# EAGLE design Div (EAGLE 8.4.0)
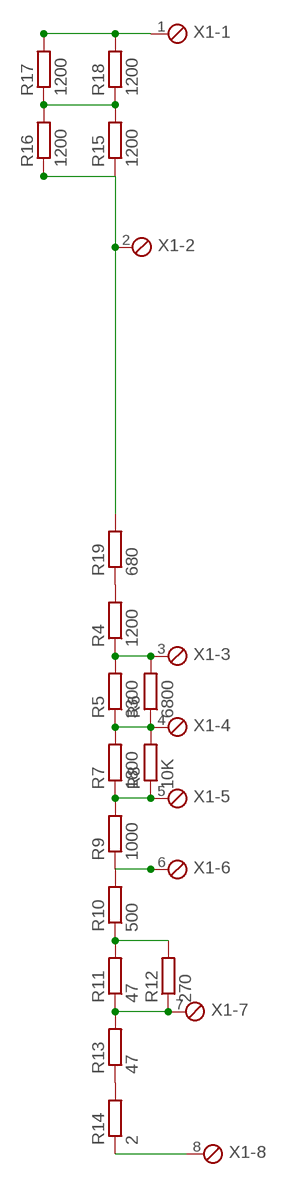
[diagram p0: schematic, sheet 1]

## Parts
R4  1200  R-EU_0309/12  [0309/12]
R5  3300  R-EU_0309/10  [0309/10]
R6  6800  R-EU_0309/10  [0309/10]
R7  1800  R-EU_0309/10  [0309/10]
R8  10K  R-EU_0309/10  [0309/10]
R9  1000  R-EU_0309/10  [0309/10]
R10  500  R-EU_0309/10  [0309/10]
R11  47  R-EU_0309/10  [0309/10]
R12  270  R-EU_0309/10  [0309/10]
R13  47  R-EU_0309/10  [0309/10]
R14  2  R-EU_0309/10  [0309/10]
R15  1200  R-EU_0309/12  [0309/12]
R16  1200  R-EU_0309/12  [0309/12]
R17  1200  R-EU_0309/12  [0309/12]
R18  1200  R-EU_0309/12  [0309/12]
R19  680  R-EU_0309/10  [0309/10]
X1  MPT8  [8POL254]

## Nets
N$1: R17.2 R18.2 X1.1
N$3: R15.1 R16.1 R19.2 X1.2
N$4: R4.1 R5.2 R6.2 X1.3
N$5: R14.1 X1.8
N$6: R5.1 R6.1 R7.2 R8.2 X1.4
N$7: R7.1 R8.1 R9.2 X1.5
N$8: R9.1 R10.2 X1.6
N$9: R10.1 R11.2 R12.2
N$10: R11.1 R12.1 R13.2 X1.7
N$11: R13.1 R14.2
N$12: R4.2 R19.1
N$13: R15.2 R16.2 R17.1 R18.1

## Library data of the parts
R4-R19 = resistor:R-EU_: RESISTOR, European symbol
X1 = con-phoenix-254:MPT8: PHOENIX CONNECTOR; OC_FARNELL: unknown; OC_NEWARK: unknown

## Board
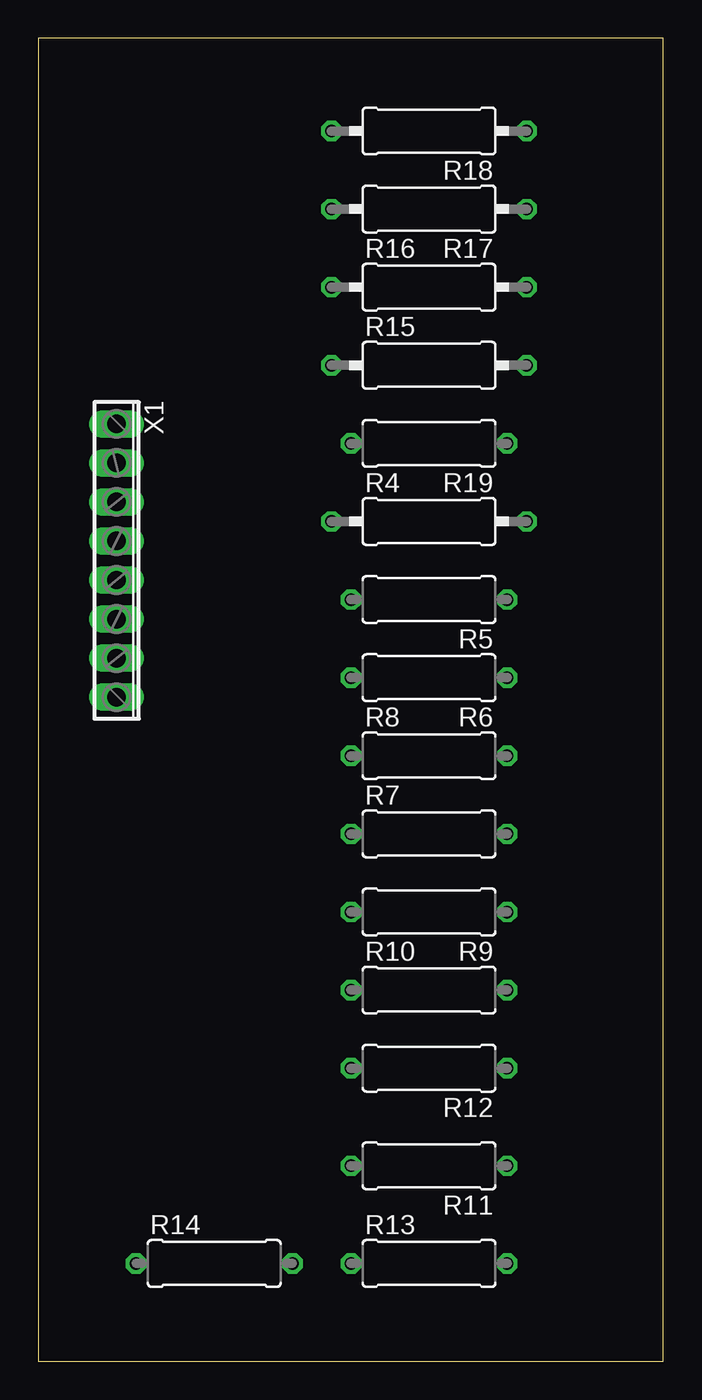
[diagram p1: board, top side]
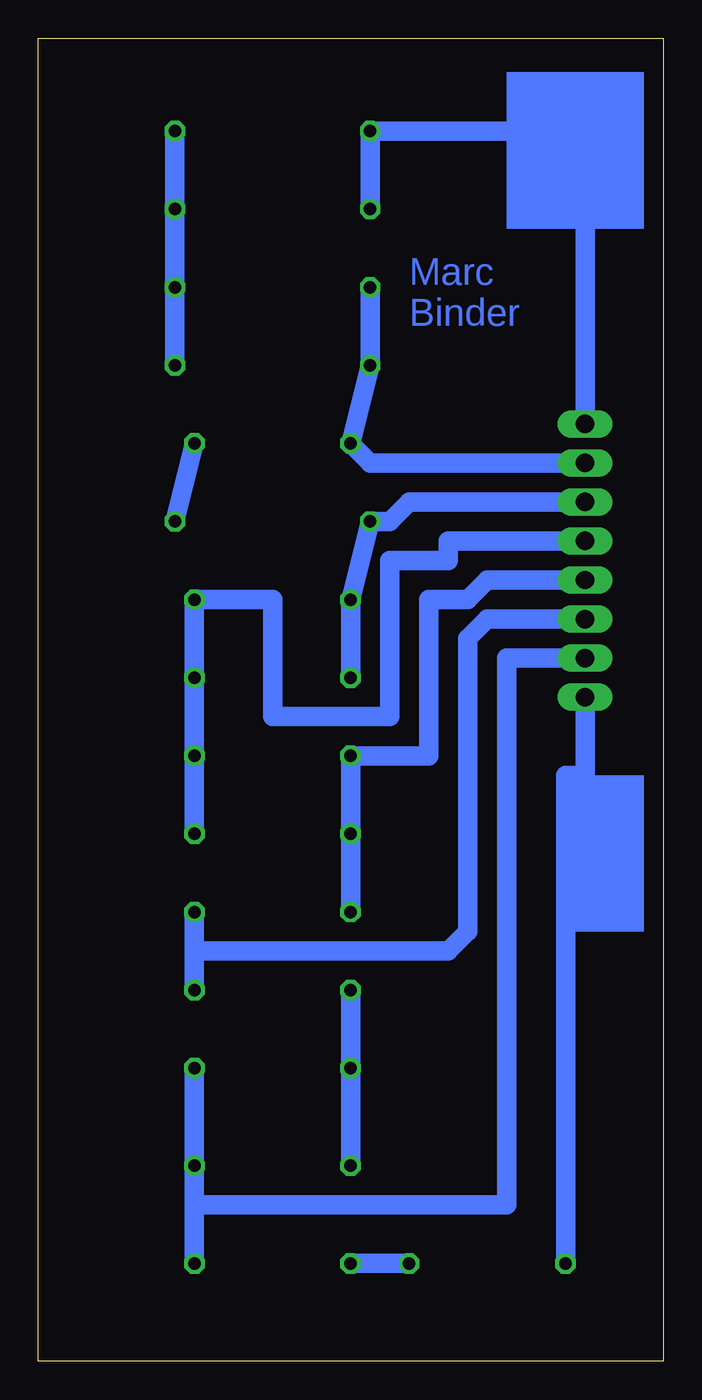
[diagram p2: board, bottom side, seen from below]

Size 40.62 x 86.03 mm. Coordinates in mm from the lower left corner, seen from the top.
Outline: 0,0 40.62,0 40.62,86.03 0,86.03 0,0
Copper layers (1*16): Top 0.035mm / dielectric 1.5mm / Bottom 0.035mm
Design rules "default": minimum track width 6mil, minimum drill 0.35mm, track to track 6mil, track to pad 6mil, pad to pad 6mil, via to via 6mil, smd to smd 6mil, copper to edge 40mil, drill to drill 6mil, minimum pad ring 10mil, minimum via ring 8mil, stop-mask expansion 4mil, vias tented up to drill 0mil, thermal gap 10mil

### Footprints (pad centres in the part's own frame; a part is rotated, then mirrored left to right if it is on the bottom)
0309/12 = drill 0.813 octagon: 1 -6.35,0; 2 6.35,0
0309/10 = drill 0.813 octagon: 1 -5.08,0; 2 5.08,0
8POL254 = drill 1.2 long: 1 -8.89,0; 2 -6.35,0; 3 -3.81,0; 4 -1.27,0; 5 1.27,0; 6 3.81,0; 7 6.35,0; 8 8.89,0

### Placement (x,y rotation side)
R4  25.4,54.61 0 top
R5  25.4,49.53 180 top
R6  25.4,44.45 180 top
R7  25.4,34.29 0 top
R8  25.4,39.37 0 top
R9  25.4,29.21 180 top
R10  25.4,24.13 0 top
R11  25.4,12.7 180 top
R12  25.4,19.05 180 top
R13  25.4,6.35 0 top
R14  11.43,6.35 0 top
R15  25.4,64.77 0 top
R16  25.4,69.85 0 top
R17  25.4,74.93 180 top
R18  25.4,80.01 180 top
R19  25.4,59.69 180 top
X1  5.08,52.07 270 top

### Tracks (layer width: path | path; a pad name or v marks a point on that pad's centre or on a via)
N$1
  Bottom 1.27: X1.1 5.08,80.01 R18.2 R17.2
N$3
  Bottom 1.27: R16.1 R15.1 R19.2 19.05,58.42 X1.2
N$4
  Bottom 1.27: R6.2 R5.2 R4.1 17.78,54.61 16.51,55.88 X1.3
N$5
  Bottom 1.27: R14.1 6.35,38.1 5.08,38.1 X1.8
N$6
  Bottom 1.27: R7.2 R8.2 R6.1 R5.1 25.4,49.53 25.4,41.91 17.78,41.91 17.78,52.07 13.97,52.07 13.97,53.34 X1.4
N$7
  Bottom 1.27: R9.2 R7.1 R8.1 15.24,39.37 15.24,49.53 12.7,49.53 11.43,50.8 X1.5
N$8
  Bottom 1.27: R9.1 30.48,26.67 | 30.48,26.67 R10.2 | 30.48,26.67 13.97,26.67 12.7,27.94 12.7,46.99 11.43,48.26 X1.6
N$9
  Bottom 1.27: R10.1 R12.2 R11.2
N$10
  Bottom 1.27: 30.48,10.16 R11.1 R12.1 | 30.48,10.16 R13.2 | X1.7 10.16,45.72 10.16,10.16 30.48,10.16
N$11
  Bottom 1.27: R13.1 R14.2
N$12
  Bottom 1.27: R19.1 R4.2
N$13
  Bottom 1.27: R18.1 R17.1 R16.2 R15.2
(copper drawn outside any net)
  shapes: Bottom area x2

### Text on the board
Bottom: Marc / Binder